# Altium schematic sheet BaseMod.SchDoc: BaseMod
size 420 x 297 mm; Author: G.Kasprowicz; CompanyName: WUT ISE; DrawnBy: G.Kasprowicz; Organization: WUT ISE; Address1: PW ISE; Address2: Nowowiejska 15/19 00-665 Warsaw; Address3: gkasprow@gmail.com; DocumentNumber: 1; Revision: 2.0; SheetNumber: 1; SheetTotal: 7; ModifiedBy: -; CheckedDate: -; Title2: Top; DivGrp: WUT ISE; Designer: G.Kasprowicz; ModifiedDate: -; ProjectName: Sensor Box
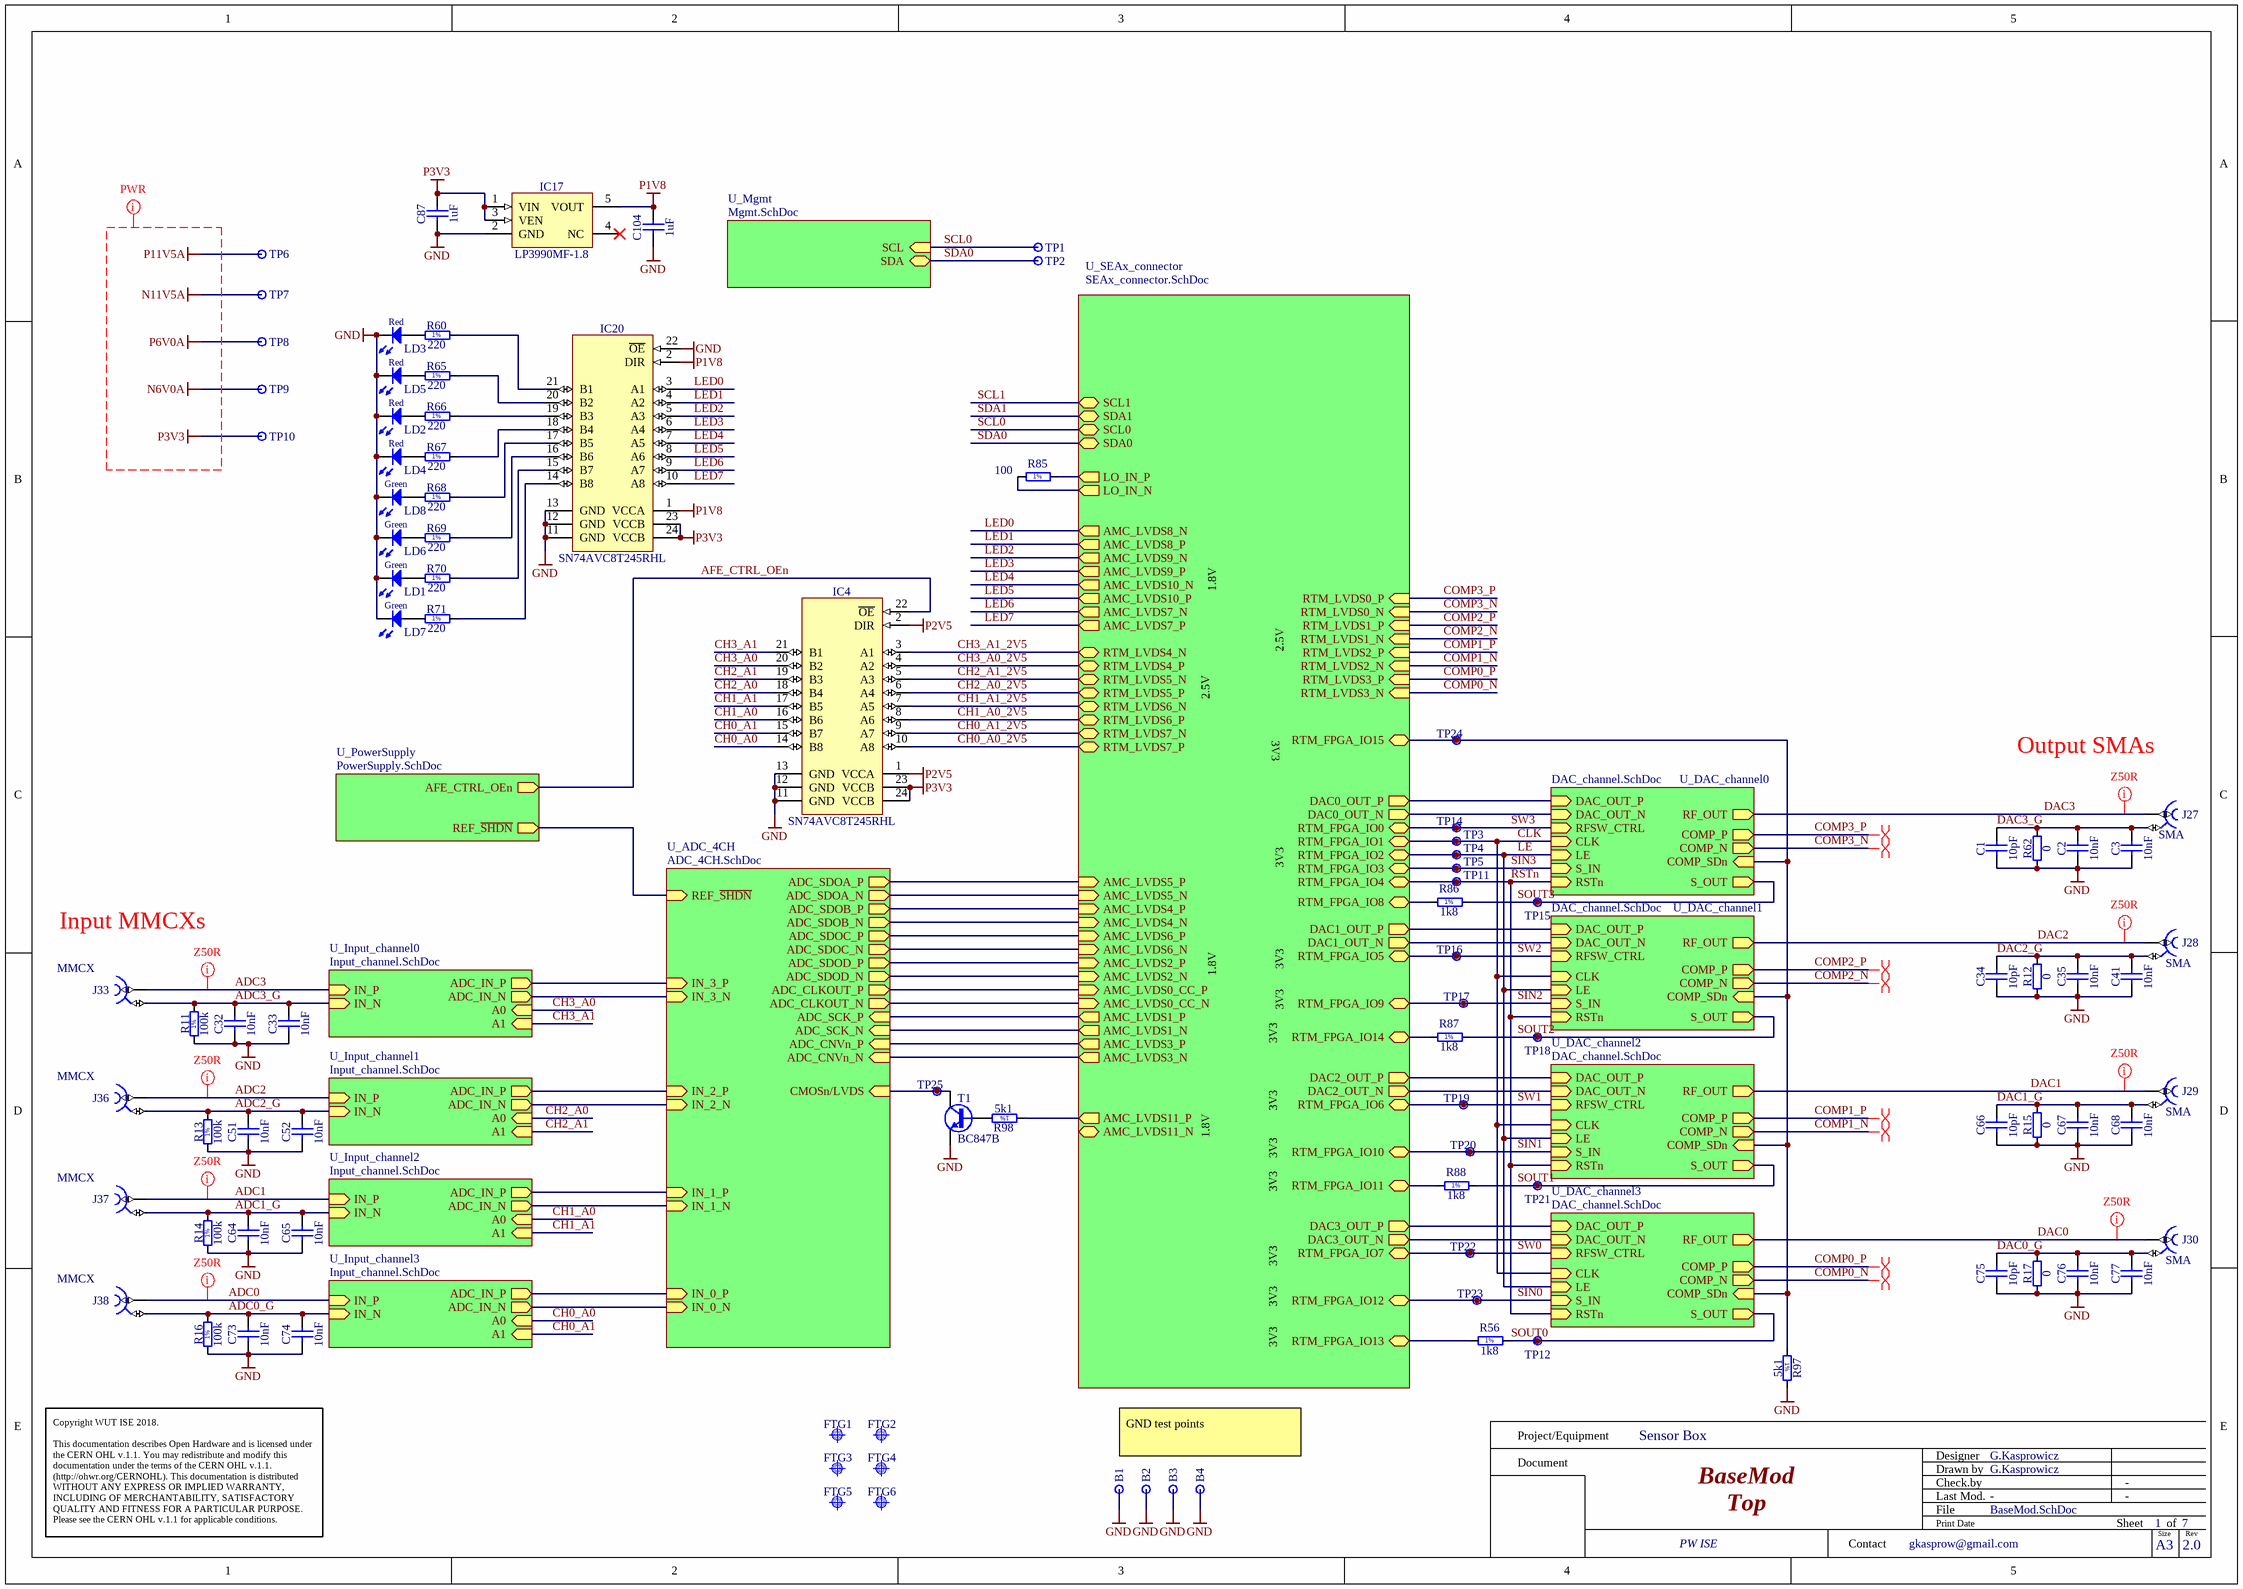
[diagram p0: BaseMod.SchDoc]

## Parts
B1  Plated Hole  [c130h80]  (value not drawn)  (no BOM)
B2  Plated Hole  [c130h80]  (value not drawn)  (no BOM)
B3  Plated Hole  [c130h80]  (value not drawn)  (no BOM)
B4  Plated Hole  [c130h80]  (value not drawn)  (no BOM)
C1  10pF  [CAPC1005X55N]
C2  10nF  [CAPC1005X55N]
C3  10nF  [CAPC1005X55N]
C32  10nF  [CAPC1005X55N]
C33  10nF  [CAPC1005X55N]
C34  10pF  [CAPC1005X55N]
C35  10nF  [CAPC1005X55N]
C41  10nF  [CAPC1005X55N]
C51  10nF  [CAPC1005X55N]
C52  10nF  [CAPC1005X55N]
C64  10nF  [CAPC1005X55N]
C65  10nF  [CAPC1005X55N]
C66  10pF  [CAPC1005X55N]
C67  10nF  [CAPC1005X55N]
C68  10nF  [CAPC1005X55N]
C73  10nF  [CAPC1005X55N]
C74  10nF  [CAPC1005X55N]
C75  10pF  [CAPC1005X55N]
C76  10nF  [CAPC1005X55N]
C77  10nF  [CAPC1005X55N]
C87  1uF  [CAPC1608X87N]
C104  1uF  [CAPC1608X87N]
FTG1  Use only in PCB  [FIDUCIAL_TOP_C100-200]  (value not drawn)
FTG2  Use only in PCB  [FIDUCIAL_TOP_S100-200]  (value not drawn)
FTG3  Use only in PCB  [FIDUCIAL_TOP_C100-200]  (value not drawn)
FTG4  Use only in PCB  [FIDUCIAL_TOP_S100-200]  (value not drawn)
FTG5  Use only in PCB  [FIDUCIAL_TOP_C100-200]  (value not drawn)
FTG6  Use only in PCB  [FIDUCIAL_TOP_S100-200]  (value not drawn)
IC4  SN74AVC8T245RHL  [TEXAS_RHL (S-PVQFN-N24)]
IC17  LP3990MF-1.8  [SOT95P284X122-5N]
IC20  SN74AVC8T245RHL  [TEXAS_RHL (S-PVQFN-N24)]
J27  SMA  [AMPHENOL_901-143_IN BOARD]
J28  SMA  [AMPHENOL_901-143_IN BOARD]
J29  SMA  [AMPHENOL_901-143_IN BOARD]
J30  SMA  [AMPHENOL_901-143_IN BOARD]
J33  Family: MMCX  [HUBER-SUHNER_85_MMCX-50-0-1/111_OE]  (hidden comment: Coax_1Female_1Shield)
J36  Family: MMCX  [HUBER-SUHNER_85_MMCX-50-0-1/111_OE]  (hidden comment: Coax_1Female_1Shield)
J37  Family: MMCX  [HUBER-SUHNER_85_MMCX-50-0-1/111_OE]  (hidden comment: Coax_1Female_1Shield)
J38  Family: MMCX  [HUBER-SUHNER_85_MMCX-50-0-1/111_OE]  (hidden comment: Coax_1Female_1Shield)
LD1  Green  [LED_KINGBRIGHT_L-13GD]
LD2  Red  [LED_KINGBRIGHT_L-13ID]
LD3  Red  [LED_KINGBRIGHT_L-13ID]
LD4  Red  [LED_KINGBRIGHT_L-13ID]
LD5  Red  [LED_KINGBRIGHT_L-13ID]
LD6  Green  [LED_KINGBRIGHT_L-13GD]
LD7  Green  [LED_KINGBRIGHT_L-13GD]
LD8  Green  [LED_KINGBRIGHT_L-13GD]
R11  100k  [RESC1608X55N]
R12  0  [RESC1608X55N]
R13  100k  [RESC1608X55N]
R14  100k  [RESC1608X55N]
R15  0  [RESC1608X55N]
R16  100k  [RESC1608X55N]
R17  0  [RESC1608X55N]
R56  1k8  [RESC1608X55N]
R60  220  [RESC1005X40N]
R62  0  [RESC1608X55N]
R65  220  [RESC1005X40N]
R66  220  [RESC1005X40N]
R67  220  [RESC1005X40N]
R68  220  [RESC1005X40N]
R69  220  [RESC1005X40N]
R70  220  [RESC1005X40N]
R71  220  [RESC1005X40N]
R85  100  [RESC1005X40N]
R86  1k8  [RESC1608X55N]
R87  1k8  [RESC1608X55N]
R88  1k8  [RESC1608X55N]
R97  5k1  [RESC1005X40N]
R98  5k1  [RESC1005X40N]
T1  BC847B  [SOT95P230X110-3N]
TP1  Test Point  [TPS127]  (value not drawn)
TP2  Test Point  [TPS127]  (value not drawn)
TP3  Test Point  [TPS127]  (value not drawn)
TP4  Test Point  [TPS127]  (value not drawn)
TP5  Test Point  [TPS127]  (value not drawn)
TP6  Test Point  [TPS127]  (value not drawn)
TP7  Test Point  [TPS127]  (value not drawn)
TP8  Test Point  [TPS127]  (value not drawn)
TP9  Test Point  [TPS127]  (value not drawn)
TP10  Test Point  [TPS127]  (value not drawn)
TP11  Test Point  [TPS127]  (value not drawn)
TP12  Test Point  [TPS127]  (value not drawn)
TP14  Test Point  [TPS127]  (value not drawn)
TP15  Test Point  [TPS127]  (value not drawn)
TP16  Test Point  [TPS127]  (value not drawn)
TP17  Test Point  [TPS127]  (value not drawn)
TP18  Test Point  [TPS127]  (value not drawn)
TP19  Test Point  [TPS127]  (value not drawn)
TP20  Test Point  [TPS127]  (value not drawn)
TP21  Test Point  [TPS127]  (value not drawn)
TP22  Test Point  [TPS127]  (value not drawn)
TP23  Test Point  [TPS127]  (value not drawn)
TP24  Test Point  [TPS127]  (value not drawn)
TP25  Test Point  [TPS127]  (value not drawn)

## Sub-sheets
U_ADC_4CH = ADC_4CH.SchDoc: ADC_SDOA_P (out), ADC_SDOA_N (out), ADC_SDOB_N (out), ADC_SDOB_P (out), ADC_CLKOUT_P (out), ADC_CLKOUT_N (out), ADC_SCK_P (in), ADC_SCK_N (in), REF_~{SHDN} (in), ADC_CNVn_N (in), ADC_CNVn_P (in), ADC_SDOD_N (out), ADC_SDOD_P (out), ADC_SDOC_N (out), ADC_SDOC_P (out), CMOSn/LVDS (in), IN_0_P (in), IN_0_N (in), IN_1_P (in), IN_1_N (in), IN_2_P (in), IN_2_N (in), IN_3_P (in), IN_3_N (in)
U_DAC_channel0 = DAC_channel.SchDoc: DAC_OUT_P (in), DAC_OUT_N (in), RF_OUT (out), RFSW_CTRL (in), S_OUT (out), RSTn (in), CLK (in), S_IN (in), LE (in), COMP_N (out), COMP_P (out), COMP_SDn (in)
U_DAC_channel1 = DAC_channel.SchDoc: DAC_OUT_P (in), DAC_OUT_N (in), RF_OUT (out), RFSW_CTRL (in), S_OUT (out), RSTn (in), CLK (in), S_IN (in), LE (in), COMP_N (out), COMP_P (out), COMP_SDn (in)
U_DAC_channel2 = DAC_channel.SchDoc: DAC_OUT_P (in), DAC_OUT_N (in), RF_OUT (out), RFSW_CTRL (in), S_OUT (out), RSTn (in), CLK (in), S_IN (in), LE (in), COMP_N (out), COMP_P (out), COMP_SDn (in)
U_DAC_channel3 = DAC_channel.SchDoc: DAC_OUT_P (in), DAC_OUT_N (in), RF_OUT (out), RFSW_CTRL (in), S_OUT (out), RSTn (in), CLK (in), S_IN (in), LE (in), COMP_N (out), COMP_P (out), COMP_SDn (in)
U_Input_channel0 = Input_channel.SchDoc: IN_N (in), A0 (in), A1 (in), IN_P (in), ADC_IN_P (out), ADC_IN_N (out)
U_Input_channel1 = Input_channel.SchDoc: IN_N (in), A0 (in), A1 (in), IN_P (in), ADC_IN_P (out), ADC_IN_N (out)
U_Input_channel2 = Input_channel.SchDoc: IN_N (in), A0 (in), A1 (in), IN_P (in), ADC_IN_P (out), ADC_IN_N (out)
U_Input_channel3 = Input_channel.SchDoc: IN_N (in), A0 (in), A1 (in), IN_P (in), ADC_IN_P (out), ADC_IN_N (out)
U_Mgmt = Mgmt.SchDoc: SDA (bidir), SCL (in)
U_PowerSupply = PowerSupply.SchDoc: REF_~{SHDN} (out), AFE_CTRL_OEn (out)
U_SEAx_connector = SEAx_connector.SchDoc: SCL1 (bidir), SDA1 (bidir), DAC3_OUT_P (out), LO_IN_N (out), LO_IN_P (out), DAC2_OUT_P (out), DAC0_OUT_P (out), DAC0_OUT_N (out), DAC3_OUT_N (out), DAC1_OUT_N (out), DAC2_OUT_N (out), DAC1_OUT_P (out), RTM_LVDS2_P (in), RTM_LVDS3_N (in), RTM_LVDS0_P (in), RTM_LVDS1_P (in), RTM_LVDS2_N (in), RTM_LVDS3_P (in), RTM_LVDS1_N (in), RTM_LVDS0_N (in), SDA0 (bidir), AMC_LVDS0_CC_P (in), AMC_LVDS0_CC_N (in), SCL0 (bidir), RTM_FPGA_IO2 (bidir), RTM_FPGA_IO8 (bidir), RTM_FPGA_IO7 (bidir), RTM_FPGA_IO4 (bidir), RTM_FPGA_IO6 (bidir), RTM_FPGA_IO5 (bidir), RTM_FPGA_IO0 (bidir), RTM_FPGA_IO1 (bidir), RTM_FPGA_IO3 (bidir), RTM_FPGA_IO14 (bidir), RTM_FPGA_IO13 (bidir), RTM_FPGA_IO15 (bidir), RTM_FPGA_IO9 (bidir), RTM_FPGA_IO12 (bidir), RTM_FPGA_IO10 (bidir), RTM_FPGA_IO11 (bidir), AMC_LVDS1_P (out), AMC_LVDS1_N (out), AMC_LVDS2_P (in), AMC_LVDS2_N (in), AMC_LVDS3_N (out), AMC_LVDS3_P (out), AMC_LVDS4_N (in), AMC_LVDS4_P (in), AMC_LVDS5_N (in), AMC_LVDS5_P (in), AMC_LVDS6_P (in), AMC_LVDS6_N (in), AMC_LVDS11_P (out), AMC_LVDS11_N (bidir), AMC_LVDS10_P (out), AMC_LVDS9_P (out), AMC_LVDS8_P (out), AMC_LVDS7_P (out), AMC_LVDS10_N (out), AMC_LVDS9_N (out), AMC_LVDS8_N (out), AMC_LVDS7_N (out), RTM_LVDS5_N (bidir), RTM_LVDS7_N (bidir), RTM_LVDS4_N (bidir), RTM_LVDS6_N (bidir), RTM_LVDS6_P (bidir), RTM_LVDS4_P (bidir), RTM_LVDS7_P (bidir), RTM_LVDS5_P (bidir)

## Nets
GND: B1.1 B2.1 B3.1 B4.1 C1.1 C2.1 C3.1 C32.1 C33.1 C34.1 C35.1 C41.1 C51.1 C52.1 C64.1 C65.1 C66.1 C67.1 C68.1 C73.1 C74.1 C75.1 C76.1 C77.1 C87.1 C104.1 IC4.11(GND) IC4.12(GND) IC4.13(GND) IC17.2(GND) IC20.11(GND) IC20.12(GND) IC20.13(GND) IC20.22(~{OE}) LD1.1(C) LD2.1(C) LD3.1(C) LD4.1(C) LD5.1(C) LD6.1(C) LD7.1(C) LD8.1(C) R11.1 R12.1 R13.1 R14.1 R15.1 R16.1 R17.1 R62.1 R97.2 T1.2(E)
N6V0A: TP9.1
N11V5A: TP7.1
P1V8: C104.2 IC17.5(VOUT) IC20.1(VCCA) IC20.2(DIR)
P2V5: IC4.1(VCCA) IC4.2(DIR)
P3V3: C87.2 IC4.23(VCCB) IC4.24(VCCB) IC17.1(VIN) IC17.3(VEN) IC20.23(VCCB) IC20.24(VCCB) TP10.1
P6V0A: TP8.1
P11V5A: TP6.1
ADC0: J38.1 ; sheet U_Input_channel3/IN_P
ADC0_G: C73.2 C74.2 J38.2 R16.2 ; sheet U_Input_channel3/IN_N
ADC1: J37.1 ; sheet U_Input_channel2/IN_P
ADC1_G: C64.2 C65.2 J37.2 R14.2 ; sheet U_Input_channel2/IN_N
ADC2: J36.1 ; sheet U_Input_channel1/IN_P
ADC2_G: C51.2 C52.2 J36.2 R13.2 ; sheet U_Input_channel1/IN_N
ADC3: J33.1 ; sheet U_Input_channel0/IN_P
ADC3_G: C32.2 C33.2 J33.2 R11.2 ; sheet U_Input_channel0/IN_N
AFE_CTRL_OEn: IC4.22(~{OE}) ; sheet U_PowerSupply/AFE_CTRL_OEn
CH0_A0: IC4.14(B8) ; sheet U_Input_channel3/A0
CH0_A0_2V5: IC4.10(A8) ; sheet U_SEAx_connector/RTM_LVDS7_P
CH0_A1: IC4.15(B7) ; sheet U_Input_channel3/A1
CH0_A1_2V5: IC4.9(A7) ; sheet U_SEAx_connector/RTM_LVDS7_N
CH1_A0: IC4.16(B6) ; sheet U_Input_channel2/A0
CH1_A0_2V5: IC4.8(A6) ; sheet U_SEAx_connector/RTM_LVDS6_P
CH1_A1: IC4.17(B5) ; sheet U_Input_channel2/A1
CH1_A1_2V5: IC4.7(A5) ; sheet U_SEAx_connector/RTM_LVDS6_N
CH2_A0: IC4.18(B4) ; sheet U_Input_channel1/A0
CH2_A0_2V5: IC4.6(A4) ; sheet U_SEAx_connector/RTM_LVDS5_P
CH2_A1: IC4.19(B3) ; sheet U_Input_channel1/A1
CH2_A1_2V5: IC4.5(A3) ; sheet U_SEAx_connector/RTM_LVDS5_N
CH3_A0: IC4.20(B2) ; sheet U_Input_channel0/A0
CH3_A0_2V5: IC4.4(A2) ; sheet U_SEAx_connector/RTM_LVDS4_P
CH3_A1: IC4.21(B1) ; sheet U_Input_channel0/A1
CH3_A1_2V5: IC4.3(A1) ; sheet U_SEAx_connector/RTM_LVDS4_N
CLK: TP3.1 ; sheet U_SEAx_connector/RTM_FPGA_IO1, sheet U_DAC_channel0/CLK, sheet U_DAC_channel1/CLK, sheet U_DAC_channel2/CLK, sheet U_DAC_channel3/CLK
COMP0_N: sheet U_SEAx_connector/RTM_LVDS3_N, sheet U_DAC_channel3/COMP_N
COMP0_P: sheet U_SEAx_connector/RTM_LVDS3_P, sheet U_DAC_channel3/COMP_P
COMP1_N: sheet U_SEAx_connector/RTM_LVDS2_N, sheet U_DAC_channel2/COMP_N
COMP1_P: sheet U_SEAx_connector/RTM_LVDS2_P, sheet U_DAC_channel2/COMP_P
COMP2_N: sheet U_SEAx_connector/RTM_LVDS1_N, sheet U_DAC_channel1/COMP_N
COMP2_P: sheet U_SEAx_connector/RTM_LVDS1_P, sheet U_DAC_channel1/COMP_P
COMP3_N: sheet U_SEAx_connector/RTM_LVDS0_N, sheet U_DAC_channel0/COMP_N
COMP3_P: sheet U_SEAx_connector/RTM_LVDS0_P, sheet U_DAC_channel0/COMP_P
DAC0: J30.1 ; sheet U_DAC_channel3/RF_OUT
DAC0_G: C75.2 C76.2 C77.2 J30.2 R17.2
DAC1: J29.1 ; sheet U_DAC_channel2/RF_OUT
DAC1_G: C66.2 C67.2 C68.2 J29.2 R15.2
DAC2: J28.1 ; sheet U_DAC_channel1/RF_OUT
DAC2_G: C34.2 C35.2 C41.2 J28.2 R12.2
DAC3: J27.1 ; sheet U_DAC_channel0/RF_OUT
DAC3_G: C1.2 C2.2 C3.2 J27.2 R62.2
LE: TP4.1 ; sheet U_SEAx_connector/RTM_FPGA_IO2, sheet U_DAC_channel0/LE, sheet U_DAC_channel1/LE, sheet U_DAC_channel2/LE, sheet U_DAC_channel3/LE
LED0: IC20.3(A1) ; sheet U_SEAx_connector/AMC_LVDS8_N
LED1: IC20.4(A2) ; sheet U_SEAx_connector/AMC_LVDS8_P
LED2: IC20.5(A3) ; sheet U_SEAx_connector/AMC_LVDS9_N
LED3: IC20.6(A4) ; sheet U_SEAx_connector/AMC_LVDS9_P
LED4: IC20.7(A5) ; sheet U_SEAx_connector/AMC_LVDS10_N
LED5: IC20.8(A6) ; sheet U_SEAx_connector/AMC_LVDS10_P
LED6: IC20.9(A7) ; sheet U_SEAx_connector/AMC_LVDS7_N
LED7: IC20.10(A8) ; sheet U_SEAx_connector/AMC_LVDS7_P
RSTn: TP11.1 ; sheet U_SEAx_connector/RTM_FPGA_IO4, sheet U_DAC_channel0/RSTn, sheet U_DAC_channel1/RSTn, sheet U_DAC_channel2/RSTn, sheet U_DAC_channel3/RSTn
SCL0: TP1.1 ; sheet U_SEAx_connector/SCL0, sheet U_Mgmt/SCL
SCL1: sheet U_SEAx_connector/SCL1
SDA0: TP2.1 ; sheet U_SEAx_connector/SDA0, sheet U_Mgmt/SDA
SDA1: sheet U_SEAx_connector/SDA1
SIN0: TP23.1 ; sheet U_SEAx_connector/RTM_FPGA_IO12, sheet U_DAC_channel3/S_IN
SIN1: TP20.1 ; sheet U_SEAx_connector/RTM_FPGA_IO10, sheet U_DAC_channel2/S_IN
SIN2: TP17.1 ; sheet U_SEAx_connector/RTM_FPGA_IO9, sheet U_DAC_channel1/S_IN
SIN3: TP5.1 ; sheet U_SEAx_connector/RTM_FPGA_IO3, sheet U_DAC_channel0/S_IN
SOUT0: R56.2 TP12.1 ; sheet U_DAC_channel3/S_OUT
SOUT1: R88.2 TP21.1 ; sheet U_DAC_channel2/S_OUT
SOUT2: R87.2 TP18.1 ; sheet U_DAC_channel1/S_OUT
SOUT3: R86.2 TP15.1 ; sheet U_DAC_channel0/S_OUT
SW0: TP22.1 ; sheet U_SEAx_connector/RTM_FPGA_IO7, sheet U_DAC_channel3/RFSW_CTRL
SW1: TP19.1 ; sheet U_SEAx_connector/RTM_FPGA_IO6, sheet U_DAC_channel2/RFSW_CTRL
SW2: TP16.1 ; sheet U_SEAx_connector/RTM_FPGA_IO5, sheet U_DAC_channel1/RFSW_CTRL
SW3: TP14.1 ; sheet U_SEAx_connector/RTM_FPGA_IO0, sheet U_DAC_channel0/RFSW_CTRL
NetIC20_14: IC20.14(B8) R71.2
NetIC20_15: IC20.15(B7) R70.2
NetIC20_16: IC20.16(B6) R69.2
NetIC20_17: IC20.17(B5) R68.2
NetIC20_18: IC20.18(B4) R67.2
NetIC20_19: IC20.19(B3) R66.2
NetIC20_20: IC20.20(B2) R65.2
NetIC20_21: IC20.21(B1) R60.2
NetLD1_2: LD1.2(A) R70.1
NetLD2_2: LD2.2(A) R66.1
NetLD3_2: LD3.2(A) R60.1
NetLD4_2: LD4.2(A) R67.1
NetLD5_2: LD5.2(A) R65.1
NetLD6_2: LD6.2(A) R69.1
NetLD7_2: LD7.2(A) R71.1
NetLD8_2: LD8.2(A) R68.1
NetR56_1: R56.1 ; sheet U_SEAx_connector/RTM_FPGA_IO13
NetR85_1: R85.1 ; sheet U_SEAx_connector/LO_IN_N
NetR85_2: R85.2 ; sheet U_SEAx_connector/LO_IN_P
NetR86_1: R86.1 ; sheet U_SEAx_connector/RTM_FPGA_IO8
NetR87_1: R87.1 ; sheet U_SEAx_connector/RTM_FPGA_IO14
NetR88_1: R88.1 ; sheet U_SEAx_connector/RTM_FPGA_IO11
NetR97_1: R97.1 TP24.1 ; sheet U_SEAx_connector/RTM_FPGA_IO15, sheet U_DAC_channel0/COMP_SDn, sheet U_DAC_channel1/COMP_SDn, sheet U_DAC_channel2/COMP_SDn, sheet U_DAC_channel3/COMP_SDn
NetR98_1: R98.1 ; sheet U_SEAx_connector/AMC_LVDS11_P
NetR98_2: R98.2 T1.1(B)
NetT1_3: T1.3(C) TP25.1 ; sheet U_ADC_4CH/CMOSn/LVDS
(unnamed): sheet U_SEAx_connector/DAC3_OUT_P, sheet U_DAC_channel3/DAC_OUT_P
(unnamed): sheet U_SEAx_connector/DAC2_OUT_P, sheet U_DAC_channel2/DAC_OUT_P
(unnamed): sheet U_SEAx_connector/DAC0_OUT_P, sheet U_DAC_channel0/DAC_OUT_P
(unnamed): sheet U_SEAx_connector/DAC0_OUT_N, sheet U_DAC_channel0/DAC_OUT_N
(unnamed): sheet U_SEAx_connector/DAC3_OUT_N, sheet U_DAC_channel3/DAC_OUT_N
(unnamed): sheet U_SEAx_connector/DAC1_OUT_N, sheet U_DAC_channel1/DAC_OUT_N
(unnamed): sheet U_SEAx_connector/DAC2_OUT_N, sheet U_DAC_channel2/DAC_OUT_N
(unnamed): sheet U_SEAx_connector/DAC1_OUT_P, sheet U_DAC_channel1/DAC_OUT_P
(unnamed): sheet U_SEAx_connector/AMC_LVDS0_CC_P, sheet U_ADC_4CH/ADC_CLKOUT_P
(unnamed): sheet U_SEAx_connector/AMC_LVDS0_CC_N, sheet U_ADC_4CH/ADC_CLKOUT_N
(unnamed): sheet U_SEAx_connector/AMC_LVDS1_P, sheet U_ADC_4CH/ADC_SCK_P
(unnamed): sheet U_SEAx_connector/AMC_LVDS1_N, sheet U_ADC_4CH/ADC_SCK_N
(unnamed): sheet U_SEAx_connector/AMC_LVDS2_P, sheet U_ADC_4CH/ADC_SDOD_P
(unnamed): sheet U_SEAx_connector/AMC_LVDS2_N, sheet U_ADC_4CH/ADC_SDOD_N
(unnamed): sheet U_SEAx_connector/AMC_LVDS3_N, sheet U_ADC_4CH/ADC_CNVn_N
(unnamed): sheet U_SEAx_connector/AMC_LVDS3_P, sheet U_ADC_4CH/ADC_CNVn_P
(unnamed): sheet U_SEAx_connector/AMC_LVDS4_N, sheet U_ADC_4CH/ADC_SDOB_N
(unnamed): sheet U_SEAx_connector/AMC_LVDS4_P, sheet U_ADC_4CH/ADC_SDOB_P
(unnamed): sheet U_SEAx_connector/AMC_LVDS5_N, sheet U_ADC_4CH/ADC_SDOA_N
(unnamed): sheet U_SEAx_connector/AMC_LVDS5_P, sheet U_ADC_4CH/ADC_SDOA_P
(unnamed): sheet U_SEAx_connector/AMC_LVDS6_P, sheet U_ADC_4CH/ADC_SDOC_P
(unnamed): sheet U_SEAx_connector/AMC_LVDS6_N, sheet U_ADC_4CH/ADC_SDOC_N
(unnamed): sheet U_PowerSupply/REF_~{SHDN}, sheet U_ADC_4CH/REF_~{SHDN}
(unnamed): sheet U_ADC_4CH/IN_0_P, sheet U_Input_channel3/ADC_IN_P
(unnamed): sheet U_ADC_4CH/IN_0_N, sheet U_Input_channel3/ADC_IN_N
(unnamed): sheet U_ADC_4CH/IN_1_P, sheet U_Input_channel2/ADC_IN_P
(unnamed): sheet U_ADC_4CH/IN_1_N, sheet U_Input_channel2/ADC_IN_N
(unnamed): sheet U_ADC_4CH/IN_2_P, sheet U_Input_channel1/ADC_IN_P
(unnamed): sheet U_ADC_4CH/IN_2_N, sheet U_Input_channel1/ADC_IN_N
(unnamed): sheet U_ADC_4CH/IN_3_P, sheet U_Input_channel0/ADC_IN_P
(unnamed): sheet U_ADC_4CH/IN_3_N, sheet U_Input_channel0/ADC_IN_N

Not connected (* = marked no-connect by the designer): IC17 4(NC)*

## Layout directives
rule Impedance Constraint [Min = 49.00    Max = 51.00    ]; net class Z50R: ADC0, ADC1, ADC2, ADC3, DAC0, DAC1, DAC2, DAC3
rule Width Constraint [Pref Width = 30mil    Min Width = 10mil    Max Width = 100mil]; net class HPWR: N6V0A, N11V5A, P3V3, P6V0A, P11V5A
differential pair: COMP0_N, COMP0_P, COMP1_N, COMP1_P, COMP2_N, COMP2_P, COMP3_N, COMP3_P

## Notes on the sheet
- 1.8V
- 2.5V
- 3V3
- Output SMAs
- Input MMCXs
- GND test points
- Project/Equipment
- Document
- Designer
- Drawn by
- Check.by
- Copyright WUT ISE 2018.
  This documentation describes Open Hardware and is licensed under the CERN OHL v.1.1. You may redistribute and modify this documentation under the terms of the CERN OHL v.1.1. (http://ohwr.org/CERNOHL). This documentation is distributed WITHOUT ANY EXPRESS OR IMPLIED WARRANTY, INCLUDING OF MERCHANTABILITY, SATISFACTORY QUALITY AND FITNESS FOR A PARTICULAR PURPOSE. Please see the CERN OHL v.1.1 for applicable conditions.
- Contact
- File
- Last Mod.
- Print Date
- Sheet
- Size
- A3
- of
- Rev
- (in symbol R0402_5K1_1%_0.0625W_100PPM) 1%
- (in symbol R0402_100R_1%_0.1W_100PPM) 1%
- (in symbol R0402_220R_1%_0.0625W_100PPM) 1%
- (in symbol R0603_1K8_1%_0.1W_100PPM) 1%
- (in symbol R0603_100K_1%_0.1W_100PPM) 1%

## Library data of the parts
B1-B4 = PLATED_HOLE0.8_PAD1.3: Single Terminal Socket; Part Description: Plated Through Hole: Hole Dia.=0.8mm Pad Dia.=1.3mm, IPC-7251 Level C; Mounted: No; Part Number: PLATED_HOLE0.8_PAD1.3; Component Type: Standard (No BOM); Pin Count: 1; Family: Plated Hole; Socket: No; SMD: No; Sense: No; Status: None; ComponentHeight: 0mm; HelpURL: Undefined; Author: CERN DEM JLC; CreateDate: 30.10.2008; LatestRevisionDate: 30.10.2008; PackageDescription: Plated Through Hole: Hole Dia.=0.8mm Pad Dia.=1.3mm, IPC-7251 Level C
C1 C34 C66 C75 = CC0402_10PF_50V_5%_C0G: Non-polarised capacitor; Part Description: SMD Multilayer Chip Ceramic Capacitor; Manufacturer: GENERIC; Manufacturer1 Part Number: C0402C100J5GACTU; Voltage: 50V; TC: C0G/NP0; Tolerance: ±5%; Part Number: CC0402_10PF_50V_5%_C0G; Component Kind: Standard; Component Type: Standard; Pin Count: 2; Value: 10pF; Status: Preferred; Manufacturer Part Number: CC0402_10PF_50V_5%_C0G; Case: 0402; Mounted: Yes; Socket: No; SMD: Yes; Sense: No; Manufacturer1 Example: KEMET; Manufacturer1 ComponentHeight: 0.55mm; HelpURL: \\cern.ch\dfs\Applications\Altium\Datasheets\CC0805_C0G_KEMET_(Commercial Grade).pdf; Author: CERN DEM JLC; CreateDate: 2007-12-03; LatestRevisionDate: 2015-04-22
C2 C3 C32 C33 C35 C41 C51 C52 C64 C65 C67 C68 C73 C74 C76 C77 = CC0402_10NF_16V_10%_X7R: Non-polarised capacitor; Part Description: SMD Multilayer Chip Ceramic Capacitor; Manufacturer: GENERIC; Manufacturer1 Part Number: 223878715636; Voltage: 16V; TC: X7R; Tolerance: ±10%; Part Number: CC0402_10NF_16V_10%_X7R; Component Kind: Standard; Component Type: Standard; Pin Count: 2; Value: 10nF; Status: Not Recommended; Manufacturer Part Number: CC0402_10NF_16V_10%_X7R; Case: 0402; Mounted: Yes; Socket: No; SMD: Yes; Sense: No; Manufacturer1 Example: PHYCOMP; Manufacturer1 ComponentHeight: 0.55mm; HelpURL: \\cern.ch\dfs\Applications\Altium\Datasheets\CC0402_X7R_PHYCOMP.pdf; Author: CERN DEM JLC; CreateDate: 2007-12-03; LatestRevisionDate: 2007-12-03
C87 C104 = CC0603_1UF_25V_10%_X7R: Non-polarised capacitor; Part Description: SMD Multilayer Chip Ceramic Capacitor; Manufacturer: GENERIC; Manufacturer1 Part Number: GRM188R71E105KA12D; Voltage: 25V; TC: X7R; Tolerance: ±10%; Part Number: CC0603_1UF_25V_10%_X7R; Component Kind: Standard; Component Type: Standard; Pin Count: 2; Value: 1uF; Status: None; Manufacturer Part Number: CC0603_1UF_25V_10%_X7R; Case: 0603; Mounted: Yes; Socket: No; SMD: Yes; Sense: No; Manufacturer1 Example: MURATA; Manufacturer1 ComponentHeight: 0.9mm; HelpURL: \\cern.ch\dfs\Applications\Altium\Datasheets\CC0603_X7R_MURATA.pdf; Author: CERN DEM JLC; CreateDate: 18.01.2011; LatestRevisionDate: 18.01.2011
FTG1 FTG3 FTG5 = FIDUCIAL_TARGET_C100-200: Fiducial Target; Part Description: Round Fiducial Target, Top Layer, 1.0mm, Top Solder 2.0mm, Keepout =2.0mm; Mounted: No; Part Number: FIDUCIAL_TARGET_C100-200; Component Kind: Standard (No BOM); Component Type: Standard (No BOM); Pin Count: 1; Family: Fiducial; Socket: No; SMD: Yes; Sense: No; Status: None; ComponentHeight: 0mm; HelpURL: Undefined; Author: CERN DEM JLC; CreateDate: 09.02.2010; LatestRevisionDate: 04.04.2012; PackageDescription: Round Fiducial Target, Top Layer, 1.0mm, Top Solder 2.0mm, Keepout =2.0mm
FTG2 FTG4 FTG6 = FIDUCIAL_TARGET_S100-200: Fiducial Target; Part Description: Square Fiducial Target, Top Layer, 1.0mm, Top Solder 2.0mm, Keepout =2.0mm; Mounted: No; Part Number: FIDUCIAL_TARGET_S100-200; Component Kind: Standard (No BOM); Component Type: Standard (No BOM); Pin Count: 1; Family: Fiducial; Socket: No; SMD: Yes; Sense: No; Status: None; ComponentHeight: 0mm; HelpURL: Undefined; Author: CERN DEM JLC; CreateDate: 09.02.2010; LatestRevisionDate: 04.04.2012; PackageDescription: Square Fiducial Target, Top Layer, 1.0mm, Top Solder 2.0mm, Keepout =2.0mm
IC4 IC20 = SN74AVC8T245RHL: 8-Bit Dual-Supply Bus Transceiver With Configurable Voltage Translation and 3-State Outputs; Manufacturer: TEXAS INSTRUMENTS; PressFit: No; Bonding: No; Part Number: SN74AVC8T245RHL; Component Kind: Standard; Component Type: Standard; Device: SN74AVC8T245RHL; PackageDescription: TEXAS Case Style RHL (S-PVQFN-N24), QFN, 0.50mm Pitch, Rectangular; 24 Pin, 5.50mm L X 3.50mm W X 1mm H body (w/thermal tab 4.05 X 2.05mm); Part Description: 8-Bit Dual-Supply Bus Transceiver With Configurable Voltage Translation and 3-State Outputs; Manufacturer Part Number: SN74AVC8T245RHL; Pin Count: 25; Case: QFN24; Mounted: Yes; Socket: No; SMD: Yes; Sense: No; ComponentHeight: 1.0mm; Author: CERN DEM MR; HelpURL: \\cern.ch\dfs\Applications\Altium\Datasheets\SN74AVC8T245RHL.pdf; CreateDate: 09.11.2016; LatestRevisionDate: 09.11.2016
IC17 = LP3990MF-1.8: 1.8V, 150mA Linear Voltage Regulator For Digital Applications; Manufacturer: TEXAS INSTRUMENTS; PressFit: No; Bonding: No; Part Number: LP3990MF-1.8; Component Kind: Standard; Component Type: Standard; Device: LP3990MF-1.8; PackageDescription: SOT23 5, Pitch 0.95mm - Body 1.67x2.99mm, IPC Medium Density; Status: Not Recommended; Part Description: 1.8V, 150mA Linear Voltage Regulator For Digital Applications; Manufacturer Part Number: LP3990MF-1.8; Pin Count: 5; Case: SOT23-5; Mounted: Yes; Socket: No; SMD: Yes; Sense: No; ComponentHeight: 1.19mm; HelpURL: \\cern.ch\dfs\Applications\Altium\Datasheets\LP3990MF-1.8.pdf; Author: CERN DEM JLC; CreateDate: 26.01.2010; LatestRevisionDate: 16.09.2014
J27-J30 = CON_SMA_RA_AMP: AMPHENOL_901-143; Part Description: 50 Ohm Through Hole SMA 90 degrees PCB Jack; PressFit: No; Part Number: AMPHENOL_901-143; Component Kind: Standard; Component Type: Standard; Pin Count: 5; Family: SMA; Mounted: Yes; Socket: No; SMD: No; Sense: No; Status: None; Manufacturer: AMPHENOL; Manufacturer Part Number: 901-143; ComponentHeight: 10.0mm; Author: LNLS DIG GBMB; CreateDate: 31/05/2016; LatestRevisionDate: 02/03/2017
J33 J36-J38 = HUBER-SUHNER_85_MMCX-50-0-1/111_OE: Part Description: MMCX 50 Ohms Right Angle PCB Jack; Manufacturer: HUBER+SUHNER; PressFit: No; Part Number: HUBER-SUHNER_85_MMCX-50-0-1/111_OE; Component Kind: Standard; Component Type: Standard; Pin Count: 2; Mounted: Yes; Socket: No; SMD: No; Sense: No; Status: None; Manufacturer Part Number: 85_MMCX-50-0-1/111_OE; ComponentHeight: 9.6mm; HelpURL: \\cern.ch\dfs\Applications\Altium\Datasheets\HUBER-SUHNER_85_MMCX-50-0-1-111_OE.pdf; Author: CERN DEM JLC; CreateDate: 06.11.2014; LatestRevisionDate: 06.11.2014
LD1 LD6-LD8 = LED_2mm_RA_Green: LED Green 2mm; Part Description: Green LED, 2mm round , RA; Manufacturer: KINGBRIGHT; Manufacturer Part Number: L-13GD; PressFit: No; Bonding: No; Part Number: LED_KINGBRIGHT_L-13GD; Component Kind: Standard; Component Type: Standard; Color: Green; PackageDescription: 2mm THT LED; Pin Count: 2; Mounted: Yes; Socket: No; SMD: No; Sense: No; ComponentHeight: 0.65mm; HelpURL: \\cern.ch\dfs\Applications\Altium\Datasheets\LED_KINGBRIGHT_KPH-1608SURCK.pdf; Author: GK; CreateDate: 03.07.2017; LatestRevisionDate: 03.07.2017
LD2-LD5 = LED_2mm_RA_Red: LED Red 2mm; Part Description: Red LED, 2mm round , RA; Manufacturer: KINGBRIGHT; Manufacturer Part Number: L-13ID; PressFit: No; Bonding: No; Part Number: LED_KINGBRIGHT_L-13ID; Component Kind: Standard; Component Type: Standard; Color: Red; PackageDescription: 2mm THT LED; Pin Count: 2; Mounted: Yes; Socket: No; SMD: No; Sense: No; ComponentHeight: 0.65mm; HelpURL: \\cern.ch\dfs\Applications\Altium\Datasheets\LED_KINGBRIGHT_KPH-1608SURCK.pdf; Author: GK; CreateDate: 03.07.2017; LatestRevisionDate: 03.07.2017
R11 R13 R14 R16 = R0603_100K_1%_0.1W_100PPM: Resistor - 1%; Part Description: General Purpose Thick Film Chip Resistor; Manufacturer: GENERIC; Manufacturer1 Part Number: NRC06F1003TRF; PressFit: No; Power: 0.1W; TC: ±100ppm/°C; Part Number: R0603_100K_1%_0.1W_100PPM; Component Kind: Standard; Component Type: Standard; Pin Count: 2; Value: 100k; Status: Preferred; Manufacturer Part Number: R0603_100K_1%_0.1W_100PPM; Case: 0603; Mounted: Yes; Sense: No; Socket: No; SMD: Yes; Manufacturer1 Example: NIC COMPONENT; Manufacturer1 ComponentHeight: 0.55mm; HelpURL: \\cern.ch\dfs\Applications\Altium\Datasheets\R0603_NIC_NRC.pdf; Author: CERN DEM JLC; CreateDate: 03.12.2007; LatestRevisionDate: 13.03.2008; Tolerance: ±1%
R12 R15 R17 R62 = R0603_0R_JUMPER: Resistor; Part Description: 1A (0.05R Max DC Resistance) Zero Ohm Jumper; Manufacturer: GENERIC; Manufacturer1 Part Number: NRC06Z0; PressFit: No; Part Number: R0603_0R_JUMPER; Component Kind: Standard; Component Type: Standard; Pin Count: 2; Value: 0; Status: Preferred; Manufacturer Part Number: R0603_0R_JUMPER; Case: 0603; Mounted: Yes; Sense: No; Socket: No; SMD: Yes; Manufacturer1 Example: NIC COMPONENT; Manufacturer1 ComponentHeight: 0.55mm; HelpURL: \\cern.ch\dfs\Applications\Altium\Datasheets\R0603_NIC_NRC.pdf; Author: CERN DEM JLC; CreateDate: 03.12.2007; LatestRevisionDate: 13.03.2008
R56 R86-R88 = R0603_1K8_1%_0.1W_100PPM: Resistor - 1%; Part Description: General Purpose Thick Film Chip Resistor; Manufacturer: GENERIC; Manufacturer1 Part Number: NRC06F1801TRF; Power: 0.1W; TC: ±100ppm/°C; Part Number: R0603_1K8_1%_0.1W_100PPM; Component Kind: Standard; Component Type: Standard; Pin Count: 2; Value: 1k8; Status: Preferred; Tolerance: ±1%; Manufacturer Part Number: R0603_1K8_1%_0.1W_100PPM; Case: 0603; Mounted: Yes; Sense: No; Socket: No; SMD: Yes; Manufacturer1 Example: NIC COMPONENT; Manufacturer1 ComponentHeight: 0.55mm; HelpURL: \\cern.ch\dfs\Applications\Altium\Datasheets\R0603_NIC_NRC.pdf; Author: CERN DEM JLC; CreateDate: 03.12.2007; LatestRevisionDate: 13.03.2008
R60 R65-R71 = R0402_220R_1%_0.0625W_100PPM: Resistor - 1%; Part Description: General Purpose Thick Film Chip Resistor; Manufacturer: GENERIC; Manufacturer1 Part Number: 232270672201L; TC: ±100ppm/°C; PressFit: No; Part Number: R0402_220R_1%_0.0625W_100PPM; Component Kind: Standard; Component Type: Standard; Pin Count: 2; Value: 220; Status: Not Recommended; Power: 0.0625W; Tolerance: ±1%; Manufacturer Part Number: R0402_220R_1%_0.0625W_100PPM; Case: 0402; Mounted: Yes; Sense: No; Socket: No; SMD: Yes; Manufacturer1 Example: YAGEO PHYCOMP; Manufacturer1 ComponentHeight: 0.4mm; HelpURL: \\cern.ch\dfs\Applications\Altium\Datasheets\R0402_Phycomp_RC0402.pdf; Author: CERN DEM JLC; CreateDate: 03.12.2007; LatestRevisionDate: 17.10.2012
R85 = R0402_100R_1%_0.1W_100PPM: Resistor - 1%; Part Description: General Purpose Thick Film Chip Resistor; Manufacturer: GENERIC; Manufacturer Part Number: R0402_100R_1%_0.1W_100PPM_50V; Manufacturer1 Part Number: ERJ2RKF1000X; Power: 0.1W; TC: ±100ppm/°C; Voltage: 50V; Part Number: R0402_100R_1%_0.1W_100PPM; Component Kind: Standard; Component Type: Standard; Pin Count: 2; Value: 100; Status: Not recommended; Tolerance: ±1%; Case: 0402; Mounted: Yes; Sense: No; Socket: No; SMD: Yes; Manufacturer1 Example: PANASONIC; Manufacturer1 ComponentHeight: 0.4mm; HelpURL: \\cern.ch\dfs\Applications\Altium\Datasheets\R0402_PANASONIC_ERJ2RK.pdf; Author: CERN DEM JLC; CreateDate: 12.12.2013; LatestRevisionDate: 03.03.2015
R97 R98 = R0402_5K1_1%_0.0625W_100PPM: Resistor - 1%; Part Description: General Purpose Thick Film Chip Resistor; Manufacturer: GENERIC; Manufacturer1 Part Number: 232270675102L; TC: ±100ppm/°C; PressFit: No; Part Number: R0402_5K1_1%_0.0625W_100PPM; Component Kind: Standard; Component Type: Standard; Pin Count: 2; Value: 5k1; Status: Not Recommended; Power: 0.0625W; Tolerance: ±1%; Manufacturer Part Number: R0402_5K1_1%_0.0625W_100PPM; Case: 0402; Mounted: Yes; Sense: No; Socket: No; SMD: Yes; Manufacturer1 Example: YAGEO PHYCOMP; Manufacturer1 ComponentHeight: 0.4mm; HelpURL: \\cern.ch\dfs\Applications\Altium\Datasheets\R0402_Phycomp_RC0402.pdf; Author: CERN DEM JLC; CreateDate: 03.12.2007; LatestRevisionDate: 17.10.2012
T1 = BC847B: NPN Transistor; Part Description: 45V 100mA NPN general-purpose transistors; Manufacturer: NXP SEMICONDUCTORS; PressFit: No; Bonding: No; Part Number: BC847B; Component Kind: Standard; Component Type: Standard; Device: BC847B; PackageDescription: SOT23, 3 pin, Pitch 0.95mm - 1.3mm W X 2.9mm L X 1.1mm H, IPC Medium Density; Manufacturer Part Number: BC847B; Pin Count: 3; Case: SOT23-3; Mounted: Yes; Socket: No; SMD: Yes; Sense: No; ComponentHeight: 1.1mm; HelpURL: \\cern.ch\dfs\Applications\Altium\Datasheets\BC847B.pdf; Author: CERN DEM JLC; CreateDate: 14.06.2011; LatestRevisionDate: 14.06.2011
TP1-TP12 TP14-TP25 = SMD_PAD_1.27X1.27MM: Part Description: 1.27mm x 1.27mm PCB Copper Area (SMD Test Point); Mounted: No; Part Number: SMD_PAD_1.27X1.27MM; Component Kind: Standard (No BOM); Component Type: Standard (No BOM); Pin Count: 1; Family: Test Point; Socket: No; SMD: Yes; Sense: No; Status: None; ComponentHeight: 0mm; HelpURL: Undefined; Author: CERN DEM JLC; CreateDate: 12.01.2008; LatestRevisionDate: 12.01.2008; PackageDescription: 1.27mm x 1.27mm PCB Copper Area (SMD Test Point)